# EAGLE design poorUSBadapter (EAGLE 7.3.0)
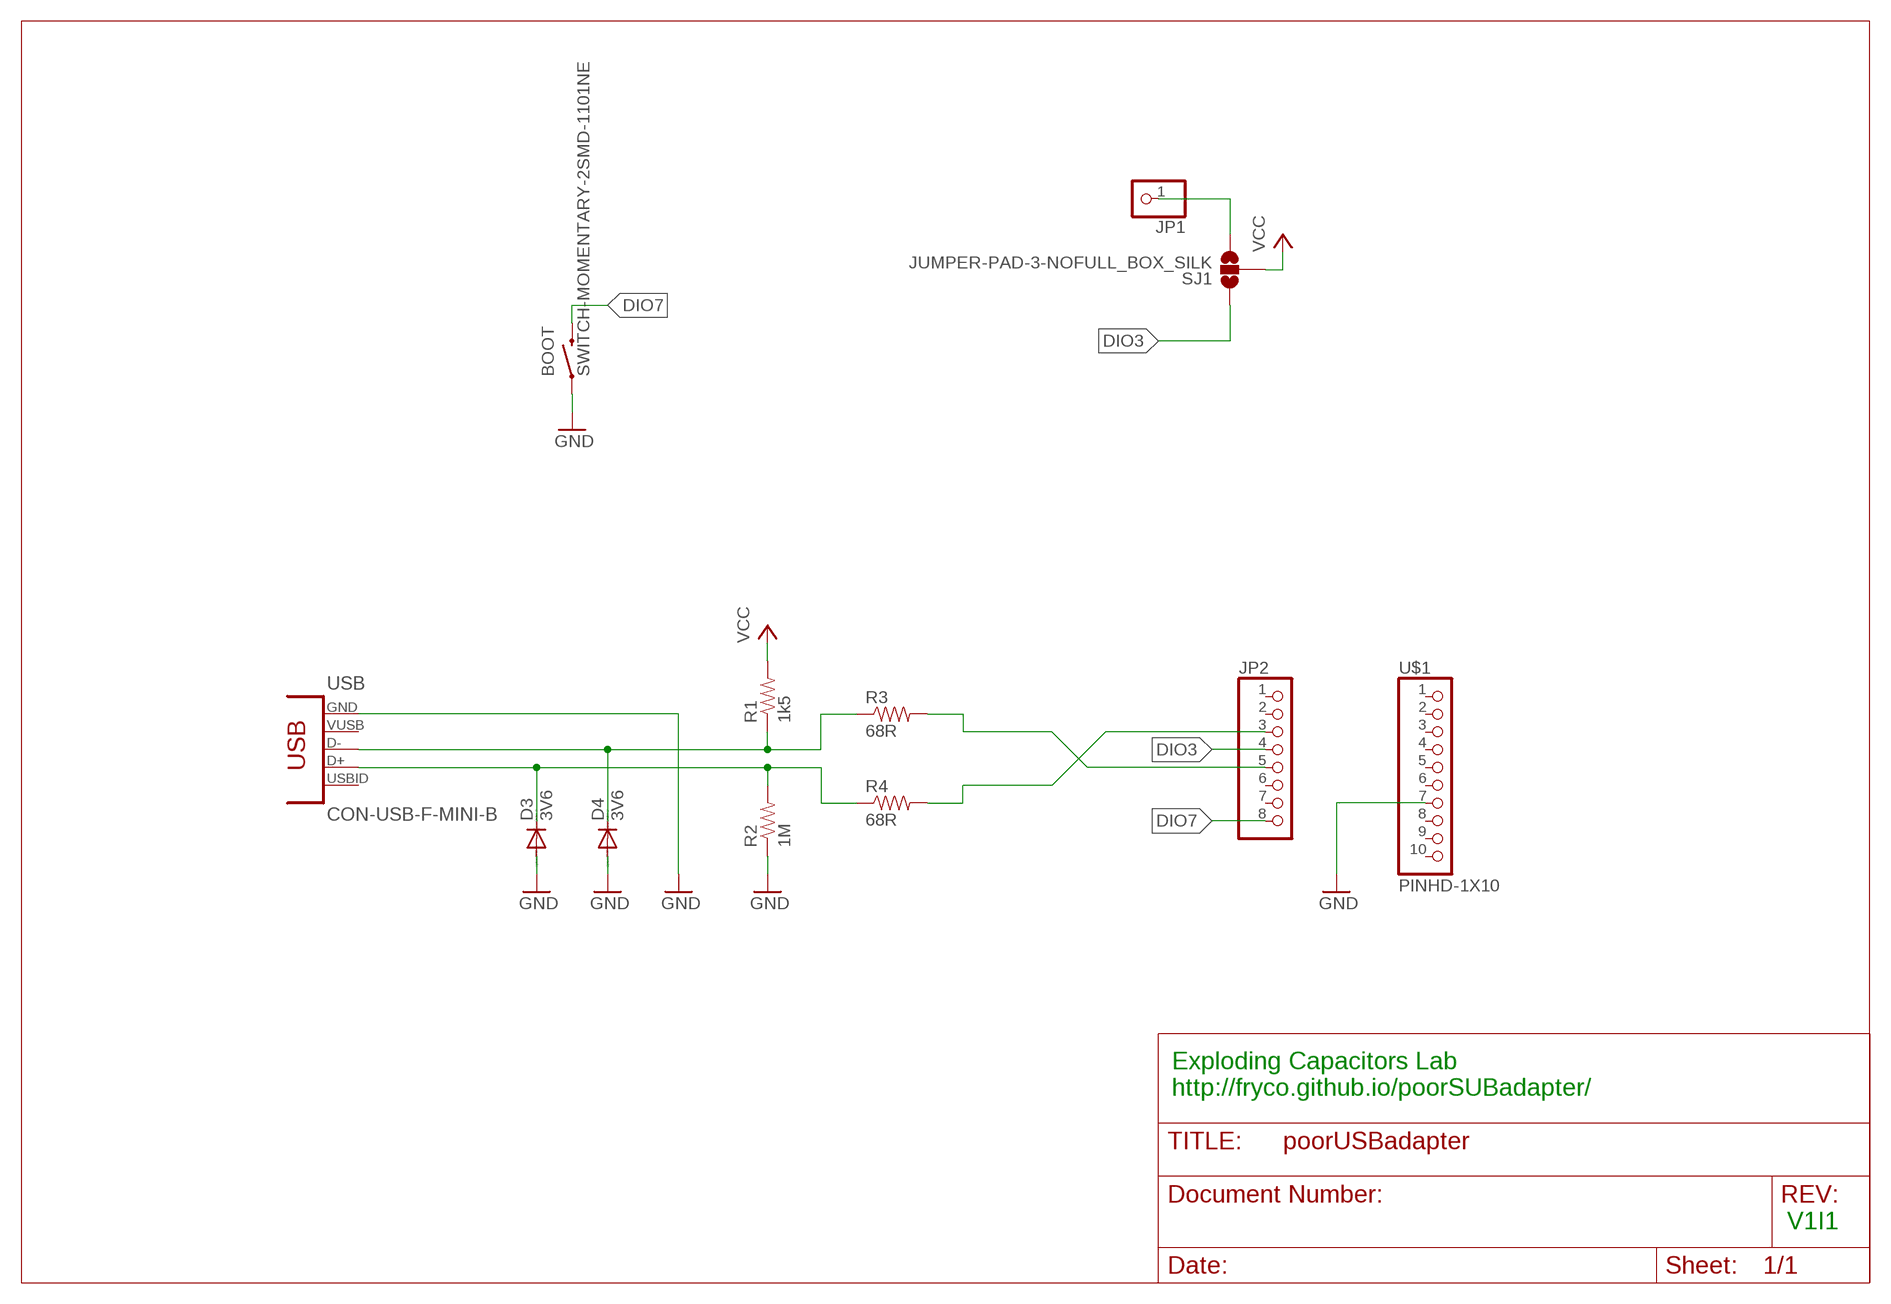
[diagram p0: schematic, sheet 1]

## Parts
BOOT  SWITCH-MOMENTARY-2SMD-1101NE  [TACTILE-SWITCH-1101NE]
D3  3V6  DIODE-MICROMELF-W  [MICROMELF-W]
D4  3V6  DIODE-MICROMELF-W  [MICROMELF-W]
JP1  PINHD-1X1  [1X01]
JP2  PINHD-1X8BIG  [1X08-BIG]
R1  1k5  RESISTOR0805-RES  [0805]
R2  1M  RESISTOR0805-RES  [0805]
R3  68R  RESISTOR0805-RES  [0805]
R4  68R  RESISTOR0805-RES  [0805]
SJ1  JUMPER-PAD-3-NOFULL_BOX_SILK  [PAD-JUMPER-3-NO_YES_SILK_FULL_BOX]
U$1  PINHD-1X10  [1X10-BIG]
USB  CON-USB-F-MINI-B  [CONN_USB_MINI-B]

## Nets
DIO3: JP2.4 SJ1.1
DIO7: BOOT.2 JP2.8
GND: BOOT.1 D3.A D4.A R2.1 U$1.7 USB.GND
N$1: JP1.1 SJ1.3
U_N: JP2.5 R3.2
U_P: JP2.3 R4.2
USB_N: D4.C R1.1 R3.1 USB.D-
USB_P: D3.C R2.2 R4.1 USB.D+
VCC: R1.2 SJ1.2
Unconnected: JP2.1 JP2.2 JP2.6 JP2.7 U$1.1 U$1.2 U$1.3 U$1.4 U$1.5 U$1.6 U$1.8 U$1.9 U$1.10 USB.BODY@1(BODY) USB.BODY@2(BODY) USB.BODY@3(BODY) USB.BODY@4(BODY) USB.ID(USBID) USB.VUSB

## Notes on the sheet
- Exploding Capacitors Lab
  http://fryco.github.io/poorSUBadapter/
- V1I1

## Library data of the parts
BOOT = SparkFun-Electromechanical:SWITCH-MOMENTARY-2: Various NO switches- pushbuttons, reed, etc; PROD_ID: SWCH-00815
D3 D4 = diode:DIODE-: DIODE
JP1 = pinhead:PINHD-1X1: PIN HEADER
JP2 = adafruit:PINHD-1X8: PIN HEADER
R1-R4 = SparkFun-Passives:RESISTOR: Resistor Basic schematic elements and footprints for 0603, 1206, and PTH resistors.
SJ1 = SparkFun-Passives:JUMPER-PAD-3-NO
U$1 = adafruit:PINHD-1X10: Pin header 1x10 0.1" spacing With round pins
USB = dp_devices:CON-USB-F: USB Female connector

## Board
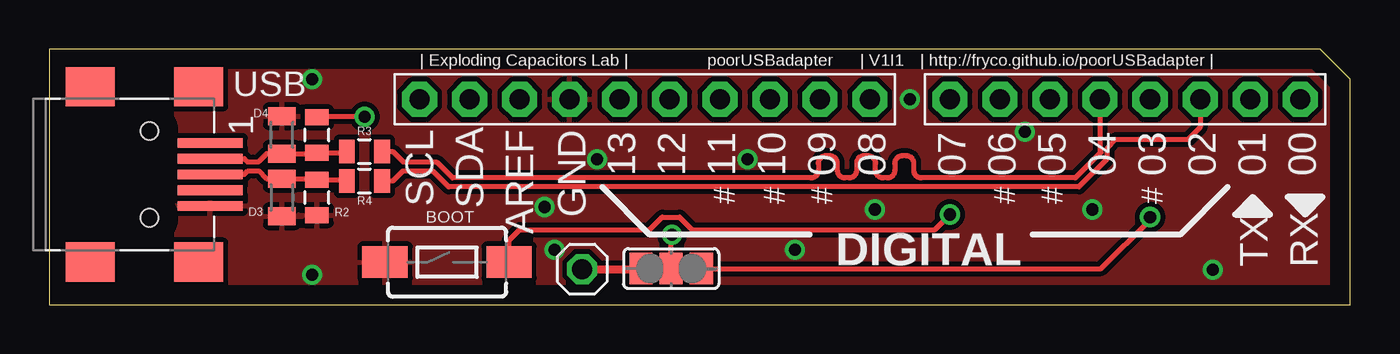
[diagram p1: board, top side]
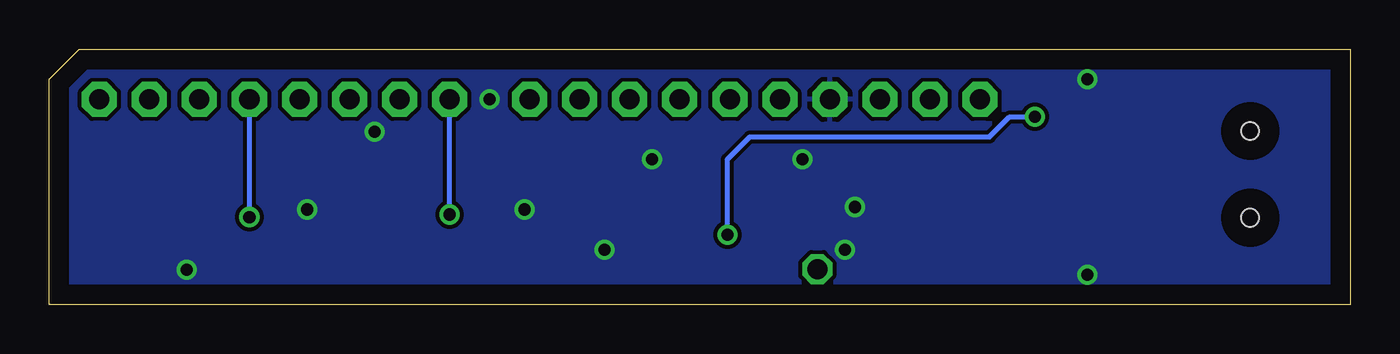
[diagram p2: board, bottom side, seen from below]

Size 66.04 x 12.96 mm. Coordinates in mm from the lower left corner, seen from the top.
Outline: 0,0 66.04,0 66.04,11.43 64.54,12.93 64.52,12.95 0,12.96 0,0
Copper layers (1*16): Top 0.035mm / dielectric 1.5mm / Bottom 0.035mm
Design rules "default": minimum track width 10mil, minimum drill 24mil, track to track 8mil, track to pad 8mil, pad to pad 8mil, via to via 8mil, smd to smd 8mil, copper to edge 40mil, drill to drill 8mil, minimum pad ring 10mil, minimum via ring 8mil, stop-mask expansion 4mil, vias tented up to drill 0mil, thermal gap 10mil

### Footprints (pad centres in the part's own frame; a part is rotated, then mirrored left to right if it is on the bottom)
TACTILE-SWITCH-1101NE = smd 2.3 x 1.6: 1 -3.15,0; 2 3.15,0
MICROMELF-W = smd 0.9 x 1.4: A 0.95,0; C -0.95,0
1X01 = drill 1.016 octagon: 1 0,0
1X08-BIG = drill 1.016 pad 1.778 octagon: 1 -8.89,0; 2 -6.35,0; 3 -3.81,0; 4 -1.27,0; 5 1.27,0; 6 3.81,0; 7 6.35,0; 8 8.89,0
0805 = smd 0.8 x 1.2: 1 -0.9,0; 2 0.9,0
PAD-JUMPER-3-NO_YES_SILK_FULL_BOX = smd 1.168 x 1.6: 1 -1.524,0; 2 0,0; 3 1.524,0
1X10-BIG = drill 1.016 pad 1.778 octagon: 1 -11.43,0; 2 -8.89,0; 3 -6.35,0; 4 -3.81,0; 5 -1.27,0; 6 1.27,0; 7 3.81,0; 8 6.35,0; 9 8.89,0; 10 11.43,0
CONN_USB_MINI-B = smd 2 x 2.5: BODY@1 -4.45,2.5; BODY@2 4.45,2.5; BODY@3 4.45,-3; BODY@4 -4.45,-3 | smd 0.5 x 3.3: D+ 0,3.1; D- -0.8,3.1; GND 1.6,3.1; ID 0.8,3.1; VUSB -1.6,3.1 | hole 0.9: -2.2,0; 2.2,0

### Placement (x,y rotation side)
BOOT  20.19,2.16 0 top
D3  11.81,5.44 270 top
D4  11.81,8.61 90 top
JP1  27.05,1.8 0 top
JP2  54.61,10.41 180 top
R1  13.59,8.61 90 top
R2  13.59,5.44 90 top
R3  16,7.77 0 top
R4  16,6.27 0 top
SJ1  31.57,1.83 180 top
U$1  30.23,10.41 180 top
USB  5.08,6.6 270 top

### Tracks (layer width: path | path; a pad name or v marks a point on that pad's centre or on a via)
DIO3  (via drill 0.61)
  Top 0.254: SJ1.1 53.39,1.83 55.88,4.32 v55.88,4.45
  Bottom 0.254: JP2.4 v55.88,4.45
DIO7  (via drill 0.61)
  Top 0.254: BOOT.2 23.34,3.28 23.88,3.81 30.48,3.81 31.11,4.45 32,4.45 32.64,3.81 44.96,3.81 v45.72,4.57
  Bottom 0.254: v45.72,4.57 JP2.8
GND  (via drill 0.61)
  other vias: 13.34,1.52 13.34,11.43 41.91,4.83 25.65,2.79 49.53,8.76 59.05,1.78 43.69,10.41 27.81,7.37 25.15,4.95 35.43,7.37 52.96,4.83 37.85,2.79
  pour Top (isolate 0.254): 0,12.95 0,0 66.04,0 66.04,11.43 64.52,12.95
  pour Bottom: 0,12.95 0,0 66.04,0 66.04,11.43 64.52,12.95
N$1
  Top 0.406: JP1.1 30.05,1.8 SJ1.3
U_N
  Top 0.254: R3.2 17.42,7.77 17.96,7.24 19.65,7.24 20.46,6.43 38.66,6.43 arc90 39.04,6.81 39.04,7.17 arc-90 39.42,7.55 39.63,7.55 arc-90 40.01,7.17 40.01,6.81 arc90 40.39,6.43 40.6,6.43 arc90 40.98,6.81 40.98,7.17 arc-90 41.36,7.55 41.57,7.55 arc-90 41.95,7.17 41.95,6.81 arc90 42.33,6.43 42.54,6.43 arc90 42.92,6.81 42.92,7.17 arc-90 43.3,7.55 43.51,7.55 arc-90 43.89,7.17 43.89,6.81 arc90 44.27,6.43 52.08,6.43 53.38,7.73 53.34,7.77 JP2.5
U_P
  Top 0.254: R4.2 17.45,6.27 17.96,6.78 19.46,6.78 20.28,5.97 52.27,5.97 53.7,7.41 53.7,7.93 54.15,8.38 57.81,8.38 58.42,8.99 JP2.3
USB_N
  Top 0.254: R3.1 15.04,7.71 R1.1 13.59,7.66 D4.C 11.04,7.66 10.62,7.24 10.07,7.24 9.91,7.4 USB.D-
USB_P
  Top 0.254: R4.1 15.04,6.34 R2.2 13.59,6.39 D3.C 11.04,6.39 10.64,6.78 10.08,6.78 9.91,6.6 USB.D+
VCC  (via drill 0.61)
  Top 0.254: SJ1.2 31.57,3.5 v31.62,3.56 | v16,9.53 14.11,9.53 R1.2
  Bottom 0.254: v31.62,3.56 31.62,7.37 30.48,8.51 18.31,8.51 17.3,9.53 v16,9.53

### Text on the board
tPlace: 13 | 12 | 11 | 10 | 09 | 08 | 07 | 06 | 05 | 04 | 03 | 02 | 01 | 00
tNames: | Exploding Capacitors Lab | | poorUSBadapter | | V1I1 | | http://fryco.github.io/poorUSBadapter | | SCL | SDA | AREF | GND | # | # | # | # | # | # | DIGITAL | TX | RX